# Altium schematic sheet PF7_FilterRoutingBypass.SchDoc
size 304 x 241 mm
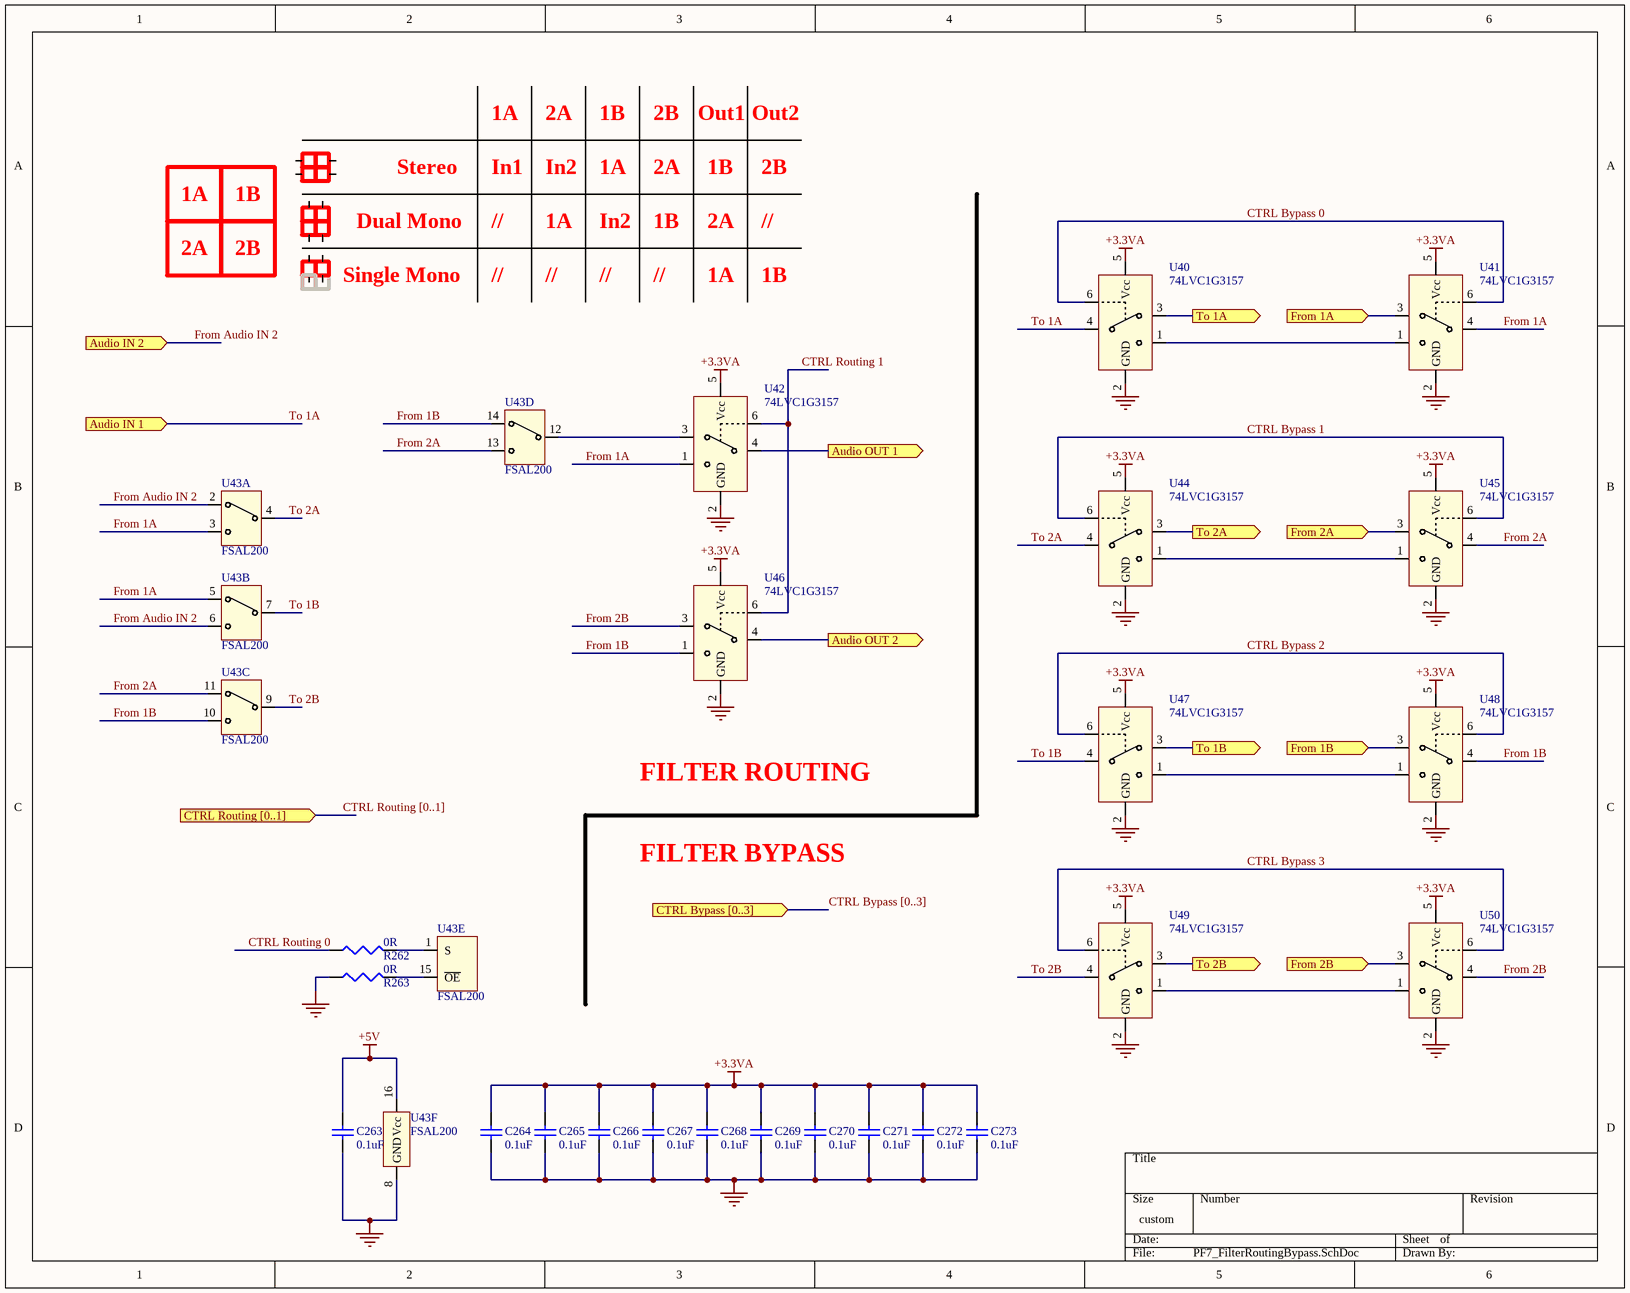
[diagram p0: PF7_FilterRoutingBypass.SchDoc]

## Parts
C263  0.1uF  [CAPC1608X08]
C264  0.1uF  [CAPC1608X08]
C265  0.1uF  [CAPC1608X08]
C266  0.1uF  [CAPC1608X08]
C267  0.1uF  [CAPC1608X08]
C268  0.1uF  [CAPC1608X08]
C269  0.1uF  [CAPC1608X08]
C270  0.1uF  [CAPC1608X08]
C271  0.1uF  [CAPC1608X08]
C272  0.1uF  [CAPC1608X08]
C273  0.1uF  [CAPC1608X08]
R262  0R  [RESC1608X05]
R263  0R  [RESC1608X05]
U40  74LVC1G3157  [DBV6-M]
U41  74LVC1G3157  [DBV6-M]
U42  74LVC1G3157  [DBV6-M]
U43  FSAL200  [TSOP65P730X110-16N]  (parts A,B,C,D,E,F of 6)
U44  74LVC1G3157  [DBV6-M]
U45  74LVC1G3157  [DBV6-M]
U46  74LVC1G3157  [DBV6-M]
U47  74LVC1G3157  [DBV6-M]
U48  74LVC1G3157  [DBV6-M]
U49  74LVC1G3157  [DBV6-M]
U50  74LVC1G3157  [DBV6-M]

## Ports
Audio IN 1 (in), Audio IN 2 (in), Audio OUT 1 (out), Audio OUT 2 (out), CTRL Bypass [0..3] (in), CTRL Routing [0..1] (in), From 1A (in), From 1B (in), From 2A (in), From 2B (in), To 1A (out), To 1B (out), To 2A (out), To 2B (out)

## Nets
+3.3VA: C264.1 C265.1 C266.1 C267.1 C268.1 C269.1 C270.1 C271.1 C272.1 C273.1 U40.5(Vcc) U41.5(Vcc) U42.5(Vcc) U44.5(Vcc) U45.5(Vcc) U46.5(Vcc) U47.5(Vcc) U48.5(Vcc) U49.5(Vcc) U50.5(Vcc)
+5V: C263.1 U43.16(Vcc)
GND: C263.2 C264.2 C265.2 C266.2 C267.2 C268.2 C269.2 C270.2 C271.2 C272.2 C273.2 R263.1 U40.2(GND) U41.2(GND) U42.2(GND) U43.8(GND) U44.2(GND) U45.2(GND) U46.2(GND) U47.2(GND) U48.2(GND) U49.2(GND) U50.2(GND)
Audio OUT 1: U42.4(A) ; port Audio OUT 1
Audio OUT 2: U46.4(A) ; port Audio OUT 2
CTRL Bypass 0: U40.6(S) U41.6(S)
CTRL Bypass 1: U44.6(S) U45.6(S)
CTRL Bypass 2: U47.6(S) U48.6(S)
CTRL Bypass 3: U49.6(S) U50.6(S)
CTRL Routing 0: R262.1
CTRL Routing 1: U42.6(S) U46.6(S)
From 1A: U41.4(A) U42.1(B2) U43.3(B2) U43.5(B1)
From 1A: U41.3(B1) ; port From 1A  [a separate net that carries the same name]
From 1B: U43.10(B2) U43.14(B1) U46.1(B2) U48.4(A)
From 1B: U48.3(B1) ; port From 1B  [a separate net that carries the same name]
From 2A: U43.11(B1) U43.13(B2) U45.4(A)
From 2A: U45.3(B1) ; port From 2A  [a separate net that carries the same name]
From 2B: U50.3(B1) ; port From 2B
From 2B: U46.3(B1) U50.4(A)  [a separate net that carries the same name]
From Audio IN 2: U43.2(B1) U43.6(B2) ; port Audio IN 2
To 1A: U40.3(B1) ; port To 1A
To 1A: U40.4(A) ; port Audio IN 1  [a separate net that carries the same name]
To 1B: U43.7(A) U47.4(A)
To 1B: U47.3(B1) ; port To 1B  [a separate net that carries the same name]
To 2A: U43.4(A) U44.4(A)
To 2A: U44.3(B1) ; port To 2A  [a separate net that carries the same name]
To 2B: U43.9(A) U49.4(A)
To 2B: U49.3(B1) ; port To 2B  [a separate net that carries the same name]
NetR262_2: R262.2 U43.1(S)
NetR263_2: R263.2 U43.15(~{OE})
NetU40_1: U40.1(B2) U41.1(B2)
NetU42_3: U42.3(B1) U43.12(A)
NetU44_1: U44.1(B2) U45.1(B2)
NetU47_1: U47.1(B2) U48.1(B2)
NetU49_1: U49.1(B2) U50.1(B2)

## Buses and harness runs
bus CTRL Bypass [0..3] = port CTRL Bypass [0..3]
bus CTRL Routing [0..1] = port CTRL Routing [0..1]

## Notes on the sheet
- 1A
- 2A
- 1B
- 2B
- Out1
- Out2
- Dual Mono
- Stereo
- In1
- //
- In2
- Single Mono
- FILTER ROUTING
- FILTER BYPASS

## Library data of the parts
C263-C273 = Cap Semi: Capacitor (Semiconductor SIM Model); Fabricant: MURATA; Fournisseur: Farnell; RefFabricant: GRM188F51E104ZA01D; RefFournisseur: 2821272; Value: 0.1uF; Case: 0603 [1608 Metric]; DataSheet: http://www.farnell.com/datasheets/2048672.pdf
R262 R263 = Res3: Resistor; Value: 0; Case: 0603 [1608 Metric]
U40-U42 U44-U49 = 74LVC1G3157: Single 2:1 Multiplexer; Fabricant: NEXPERIA; Fournisseur: Farnell; RefFabricant: 74LVC1G3157GV,125; RefFournisseur: 2463921; DataSheet: http://www.farnell.com/datasheets/2053574.pdf
U43 = FSAL200: Quad 2:1 Multiplexer; Fabricant: ON SEMICONDUCTOR; Fournisseur: Farnell; RefFabricant: FSAL200QSCX; RefFournisseur: 2450768; DataSheet: http://www.farnell.com/datasheets/2299862.pdf
U50 = 74LVC1G3157: Single 2:1 Multiplexer; Fournisseur: Farnell; Fabricant: NEXPERIA; RefFabricant: 74LVC1G3157GV,125; RefFournisseur: 2463921; DataSheet: http://www.farnell.com/datasheets/2053574.pdf